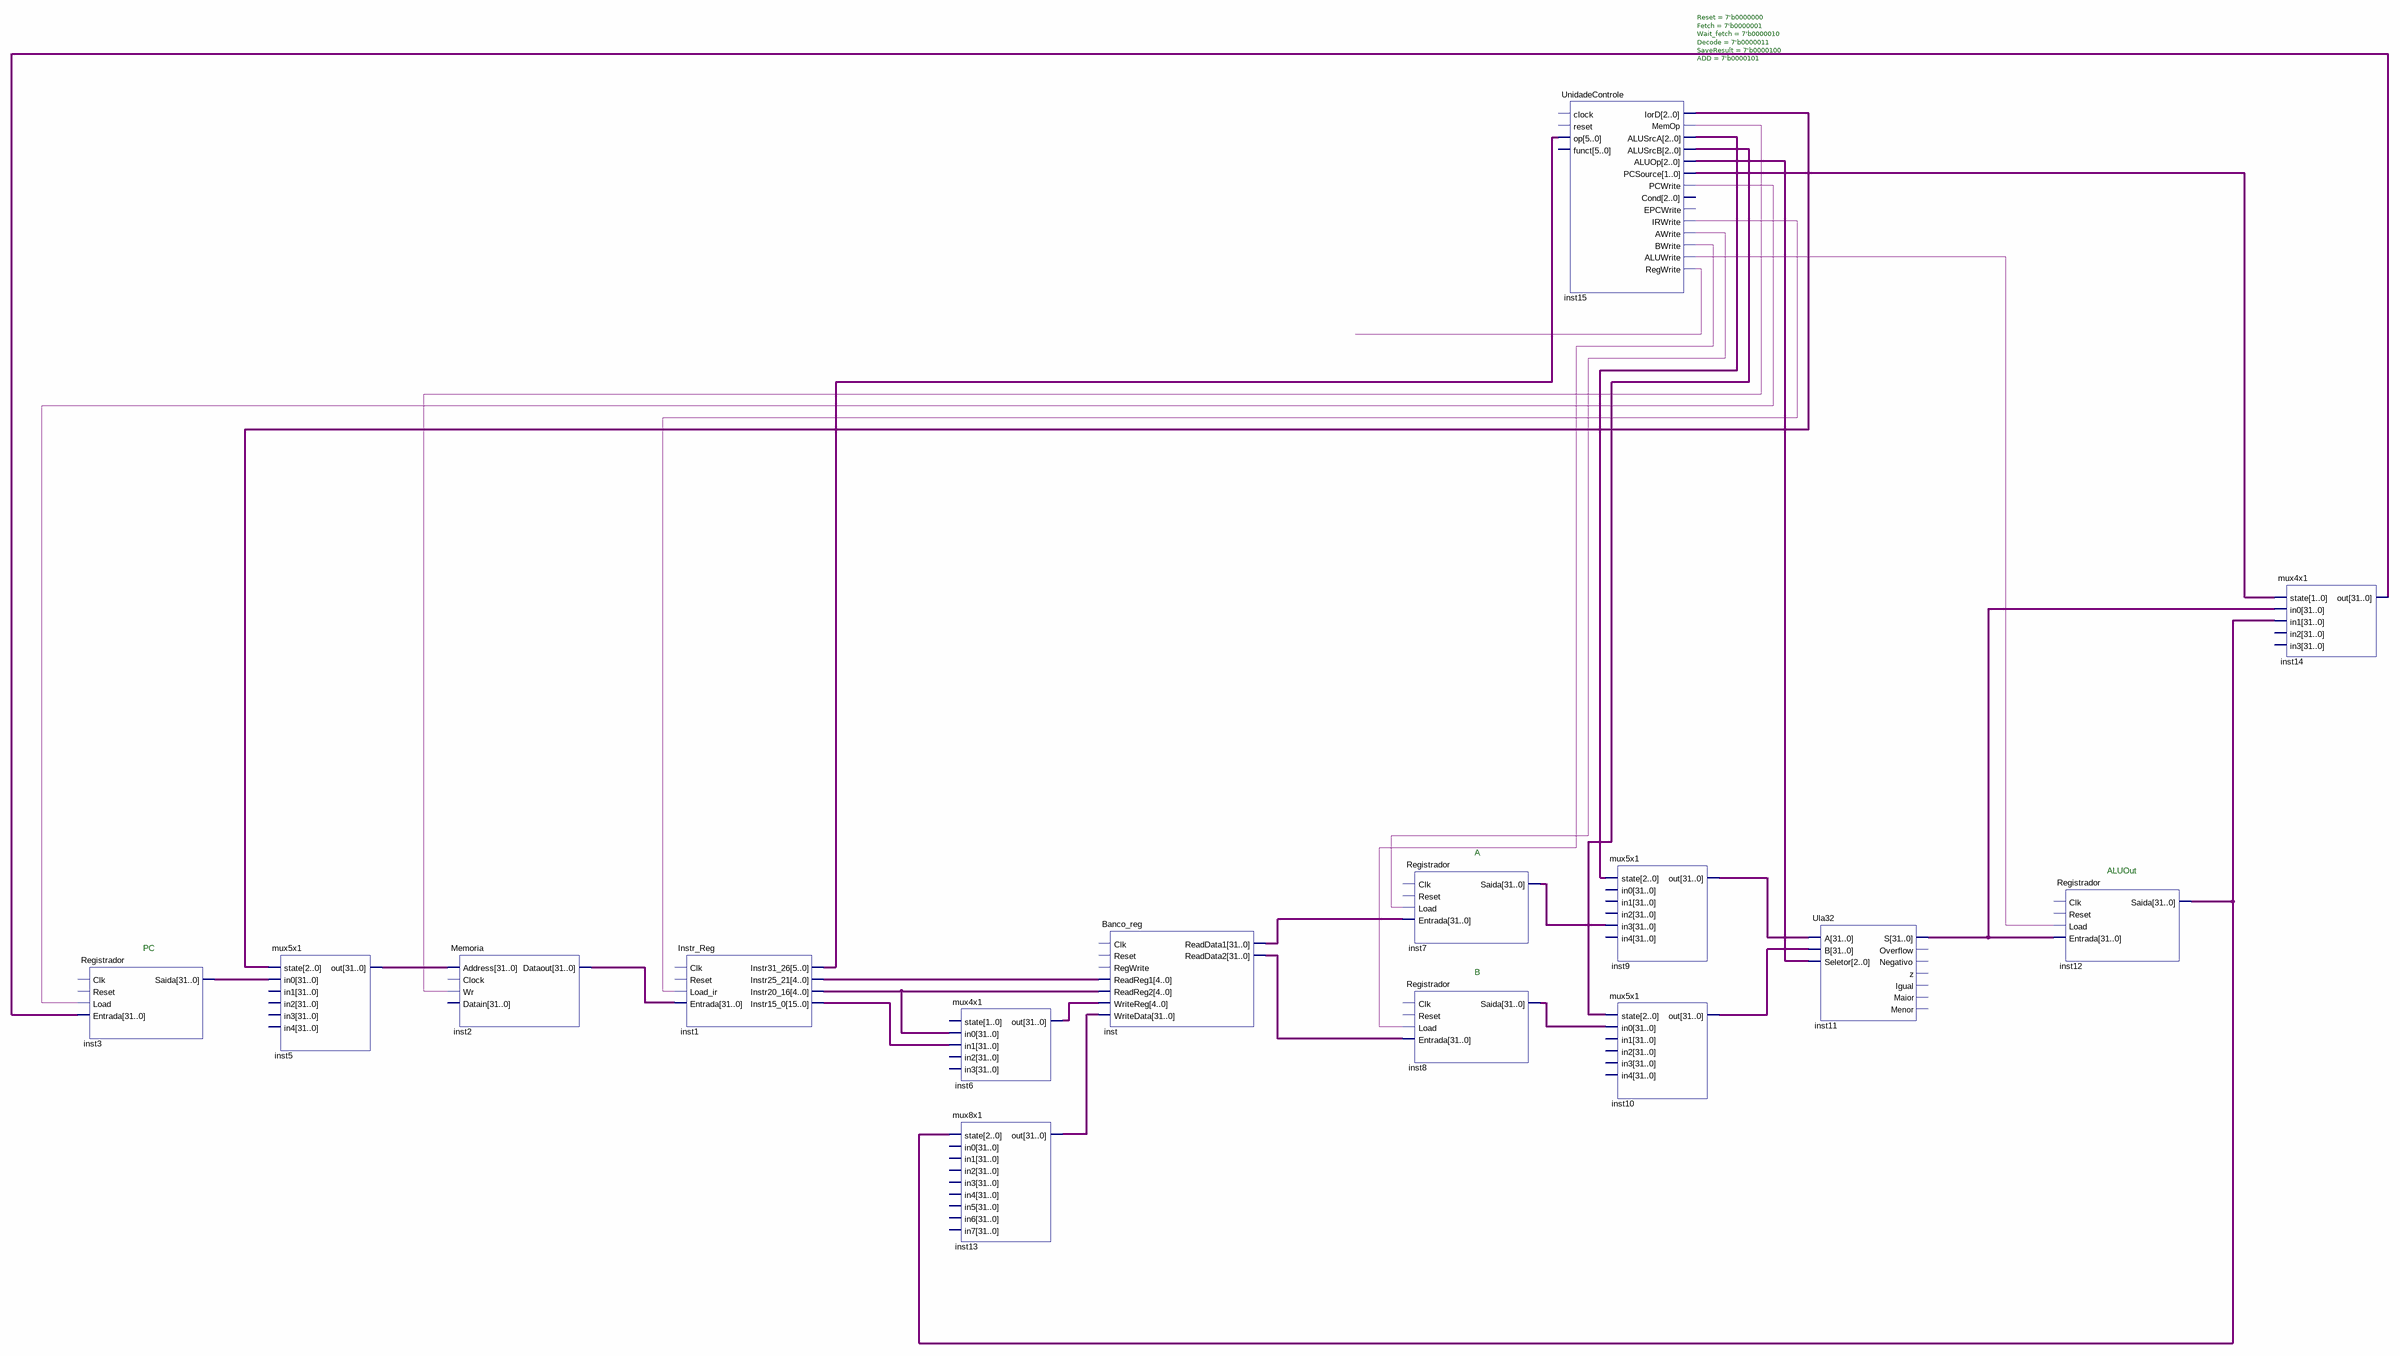
[diagram p0: schematic sheet]
// Quartus schematic Cpu.bdf as structural Verilog: 15 symbols, 0 pins
module Cpu (
);

  wire inst15_aluwrite, inst15_awrite, inst15_bwrite, inst15_irwrite, inst15_memop, inst15_pcwrite,
       inst15_regwrite;
  wire [1:0] inst15_pcsource;
  wire [2:0] inst15_aluop, inst15_alusrca, inst15_alusrcb, inst15_iord;
  wire [4:0] inst1_instr25_21;
  wire [5:0] inst1_instr31_26;
  wire [31:0] inst1_instr15_0, inst1_instr20_16, inst2_dataout, inst3_saida, inst5_out, inst6_out,
       inst7_saida, inst8_saida, inst9_out, inst10_out, inst11_s, inst12_saida, inst13_out, inst14_out,
       inst_readdata1, inst_readdata2;

  Registrador inst3 (.Load(inst15_pcwrite), .Entrada(inst14_out), .Saida(inst3_saida));  // open: Clk, Reset
  mux5x1 inst5 (.state(inst15_iord), .in0(inst3_saida), .out(inst5_out));  // open: in1, in2, in3, in4
  Memoria inst2 (.Address(inst5_out), .Wr(inst15_memop), .Dataout(inst2_dataout));  // open: Clock, Datain
  Instr_Reg inst1 (
    .Load_ir(inst15_irwrite), .Entrada(inst2_dataout), .Instr31_26(inst1_instr31_26),
    .Instr25_21(inst1_instr25_21), .Instr20_16(inst1_instr20_16), .Instr15_0(inst1_instr15_0));  // open: Clk, Reset
  mux4x1 inst6 (.in0(inst1_instr20_16), .in1(inst1_instr15_0), .out(inst6_out));  // open: state, in2, in3
  mux8x1 inst13 (.state(inst12_saida), .out(inst13_out));  // open: in0, in1, in2, in3, in4, in5, in6, in7
  Banco_reg inst (
    .ReadReg1(inst1_instr25_21), .ReadReg2(inst1_instr20_16), .WriteReg(inst6_out), .WriteData(inst13_out),
    .ReadData1(inst_readdata1), .ReadData2(inst_readdata2));  // open: Clk, Reset, RegWrite
  Registrador inst7 (.Load(inst15_awrite), .Entrada(inst_readdata1), .Saida(inst7_saida));  // open: Clk, Reset
  Registrador inst8 (.Load(inst15_bwrite), .Entrada(inst_readdata2), .Saida(inst8_saida));  // open: Clk, Reset
  UnidadeControle #(.Reset(7'b0000000), .Fetch(7'b0000001), .Wait_fetch(7'b0000010), .Decode(7'b0000011), .SaveResult(7'b0000100), .ADD(7'b0000101)) inst15 (
    .op(inst1_instr31_26), .IorD(inst15_iord), .MemOp(inst15_memop), .ALUSrcA(inst15_alusrca),
    .ALUSrcB(inst15_alusrcb), .ALUOp(inst15_aluop), .PCSource(inst15_pcsource), .PCWrite(inst15_pcwrite),
    .IRWrite(inst15_irwrite), .AWrite(inst15_awrite), .BWrite(inst15_bwrite), .ALUWrite(inst15_aluwrite),
    .RegWrite(inst15_regwrite));  // open: clock, reset, funct, Cond, EPCWrite
  mux5x1 inst9 (.state(inst15_alusrca), .in3(inst7_saida), .out(inst9_out));  // open: in0, in1, in2, in4
  mux5x1 inst10 (.state(inst15_alusrcb), .in0(inst8_saida), .out(inst10_out));  // open: in1, in2, in3, in4
  Ula32 inst11 (
    .A(inst9_out), .B(inst10_out), .Seletor(inst15_aluop), .S(inst11_s));  // open: Overflow, Negativo, z, Igual, Maior, Menor
  Registrador inst12 (.Load(inst15_aluwrite), .Entrada(inst11_s), .Saida(inst12_saida));  // open: Clk, Reset
  mux4x1 inst14 (.state(inst15_pcsource), .in0(inst11_s), .in1(inst12_saida), .out(inst14_out));  // open: in2, in3

  // Notes on the sheet:
  //   A
  //   ALUOut
  //   PC
  //   B
endmodule
